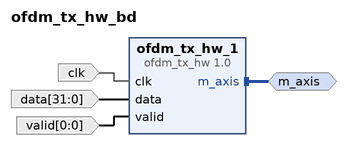
[diagram p0: block diagram of the top level]
# Vivado block design ofdm_tx_hw_bd, xczu28dr-ffvg1517-2-e, Vivado 2020.1
create_bd_design ofdm_tx_hw_bd

create_bd_intf_port -mode Master -vlnv xilinx.com:interface:axis_rtl:1.0 m_axis
create_bd_port -dir I -type clk clk
create_bd_port -dir I -from 31 -to 0 -type data data
create_bd_port -dir I -from 0 -to 0 -type data valid

create_bd_cell -type ip -vlnv User_Company:SysGen:ofdm_tx_hw:1.0 ofdm_tx_hw_1

# ---- connections ----

connect_bd_intf_net [get_bd_intf_ports m_axis] [get_bd_intf_pins ofdm_tx_hw_1/m_axis]
connect_bd_net [get_bd_ports clk] [get_bd_pins ofdm_tx_hw_1/clk]
connect_bd_net [get_bd_ports data] [get_bd_pins ofdm_tx_hw_1/data]
connect_bd_net [get_bd_ports valid] [get_bd_pins ofdm_tx_hw_1/valid]

validate_bd_design
save_bd_design
